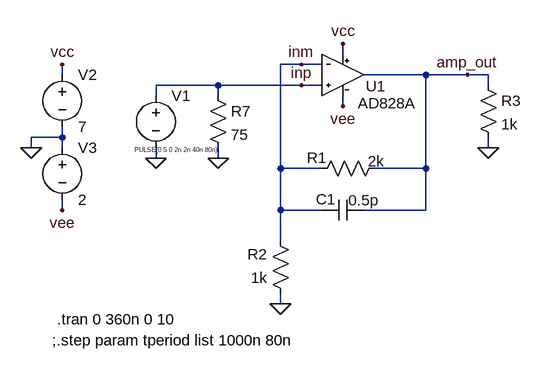
[diagram p0: schematic 02-ad828_amplifier.asc]
02-ad828_amplifier.asc, the LTspice schematic file:
Version 4
SHEET 1 1208 680
WIRE 544 112 544 96
WIRE 480 128 448 128
WIRE 512 128 480 128
WIRE 112 144 112 128
WIRE 672 144 576 144
WIRE 736 144 672 144
WIRE 768 144 736 144
WIRE 352 160 256 160
WIRE 480 160 352 160
WIRE 512 160 480 160
WIRE 768 160 768 144
WIRE 256 176 256 160
WIRE 352 176 352 160
WIRE 544 192 544 176
WIRE 112 240 112 224
WIRE 112 240 64 240
WIRE 64 256 64 240
WIRE 112 256 112 240
WIRE 768 256 768 240
WIRE 256 272 256 256
WIRE 352 272 352 256
WIRE 448 288 448 128
WIRE 512 288 448 288
WIRE 672 288 672 144
WIRE 672 288 592 288
WIRE 112 352 112 336
WIRE 448 352 448 288
WIRE 512 352 448 352
WIRE 672 352 672 288
WIRE 672 352 576 352
WIRE 448 400 448 352
WIRE 448 496 448 480
FLAG 256 272 0
FLAG 64 256 0
FLAG 112 128 vcc
FLAG 448 496 0
FLAG 544 96 vcc
FLAG 480 160 inp
FLAG 768 256 0
FLAG 112 352 vee
FLAG 736 144 amp_out
FLAG 352 272 0
FLAG 480 128 inm
FLAG 544 192 vee
SYMBOL voltage 256 160 R0
WINDOW 3 -33 99 Left 0
WINDOW 123 0 0 Left 0
WINDOW 39 0 0 Left 0
SYMATTR Value PULSE(0 5 0 2n 2n 40n 80n)
SYMATTR InstName V1
SYMBOL res 608 272 R90
WINDOW 0 15 104 VBottom 2
WINDOW 3 -11 13 VTop 2
SYMATTR InstName R1
SYMATTR Value 2k
SYMBOL res 464 496 R180
WINDOW 0 36 76 Left 2
WINDOW 3 36 40 Left 2
SYMATTR InstName R2
SYMATTR Value 1k
SYMBOL voltage 112 128 R0
WINDOW 123 0 0 Left 0
WINDOW 39 0 0 Left 0
SYMATTR InstName V2
SYMATTR Value 7
SYMBOL res 752 144 R0
SYMATTR InstName R3
SYMATTR Value 1k
SYMBOL voltage 112 240 R0
WINDOW 123 0 0 Left 0
WINDOW 39 0 0 Left 0
SYMATTR InstName V3
SYMATTR Value 2
SYMBOL cap 576 336 R90
WINDOW 0 15 58 VBottom 2
WINDOW 3 -15 0 VTop 2
SYMATTR InstName C1
SYMATTR Value 0.5p
SYMBOL res 336 160 R0
SYMATTR InstName R7
SYMATTR Value 75
SYMBOL AD828A 544 144 R0
SYMATTR InstName U1
TEXT 104 520 Left 2 !.tran 0 360n 0 10
TEXT 96 552 Left 2 !;.step param tperiod list 1000n 80n

The netlist it stands for:
* 02-ad828_amplifier.asc
V1 inp 0 PULSE(0 5 0 2n 2n 40n 80n)
R1 amp_out inm 2k
R2 0 inm 1k
V2 vcc 0 7
R3 amp_out 0 1k
V3 0 vee 2
C1 amp_out inm 0.5p
R7 inp 0 75
XU1 inp inm vcc vee amp_out AD828A  ; pins 2 1 99 50 46
.tran 0 360n 0 10
;.step param tperiod list 1000n 80n
.lib C:\Users\SGI-U3\Documents\GitHub\LTspice\01-lib\ad828a.cir
.backanno
.end

* Results of the author's LTspice run, read from the files saved beside the schematic
* Operating Point, zero values left out:
*   V(amp_out) = 24.62 mV
*   V(inm) = 3.895 mV
*   V(vcc) = 7 V
*   V(vee) = -2 V
*   I(R1) = 10.36 µA
*   I(R2) = -3.895 µA
*   I(R3) = 24.62 µA
*   I(V1) = -6.733 µA
*   I(V2) = -7.011 mA
*   I(V3) = -6.987 mA
*   Ix(u1:2) = 6.733 µA
*   Ix(u1:1) = 6.467 µA
*   Ix(u1:99) = 7.011 mA
*   Ix(u1:50) = -6.987 mA
*   Ix(u1:46) = -34.98 µA
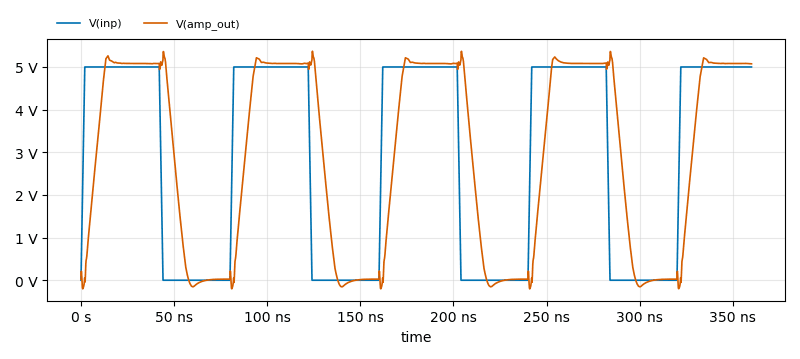
[diagram p1: Transient Analysis of 02-ad828_amplifier.asc, plotted from the saved traces]
* Transient Analysis, 1 run:
*   V(inp): min 0 V, max 5 V, average 2.875 V, rms 3.764 V, last 5 V
*   V(amp_out): min -202 mV, max 5.369 V, average 2.923 V, rms 3.704 V, last 5.074 V